# Altium schematic sheet Page07 CPU PHY.SchDoc
size 386 x 246 mm
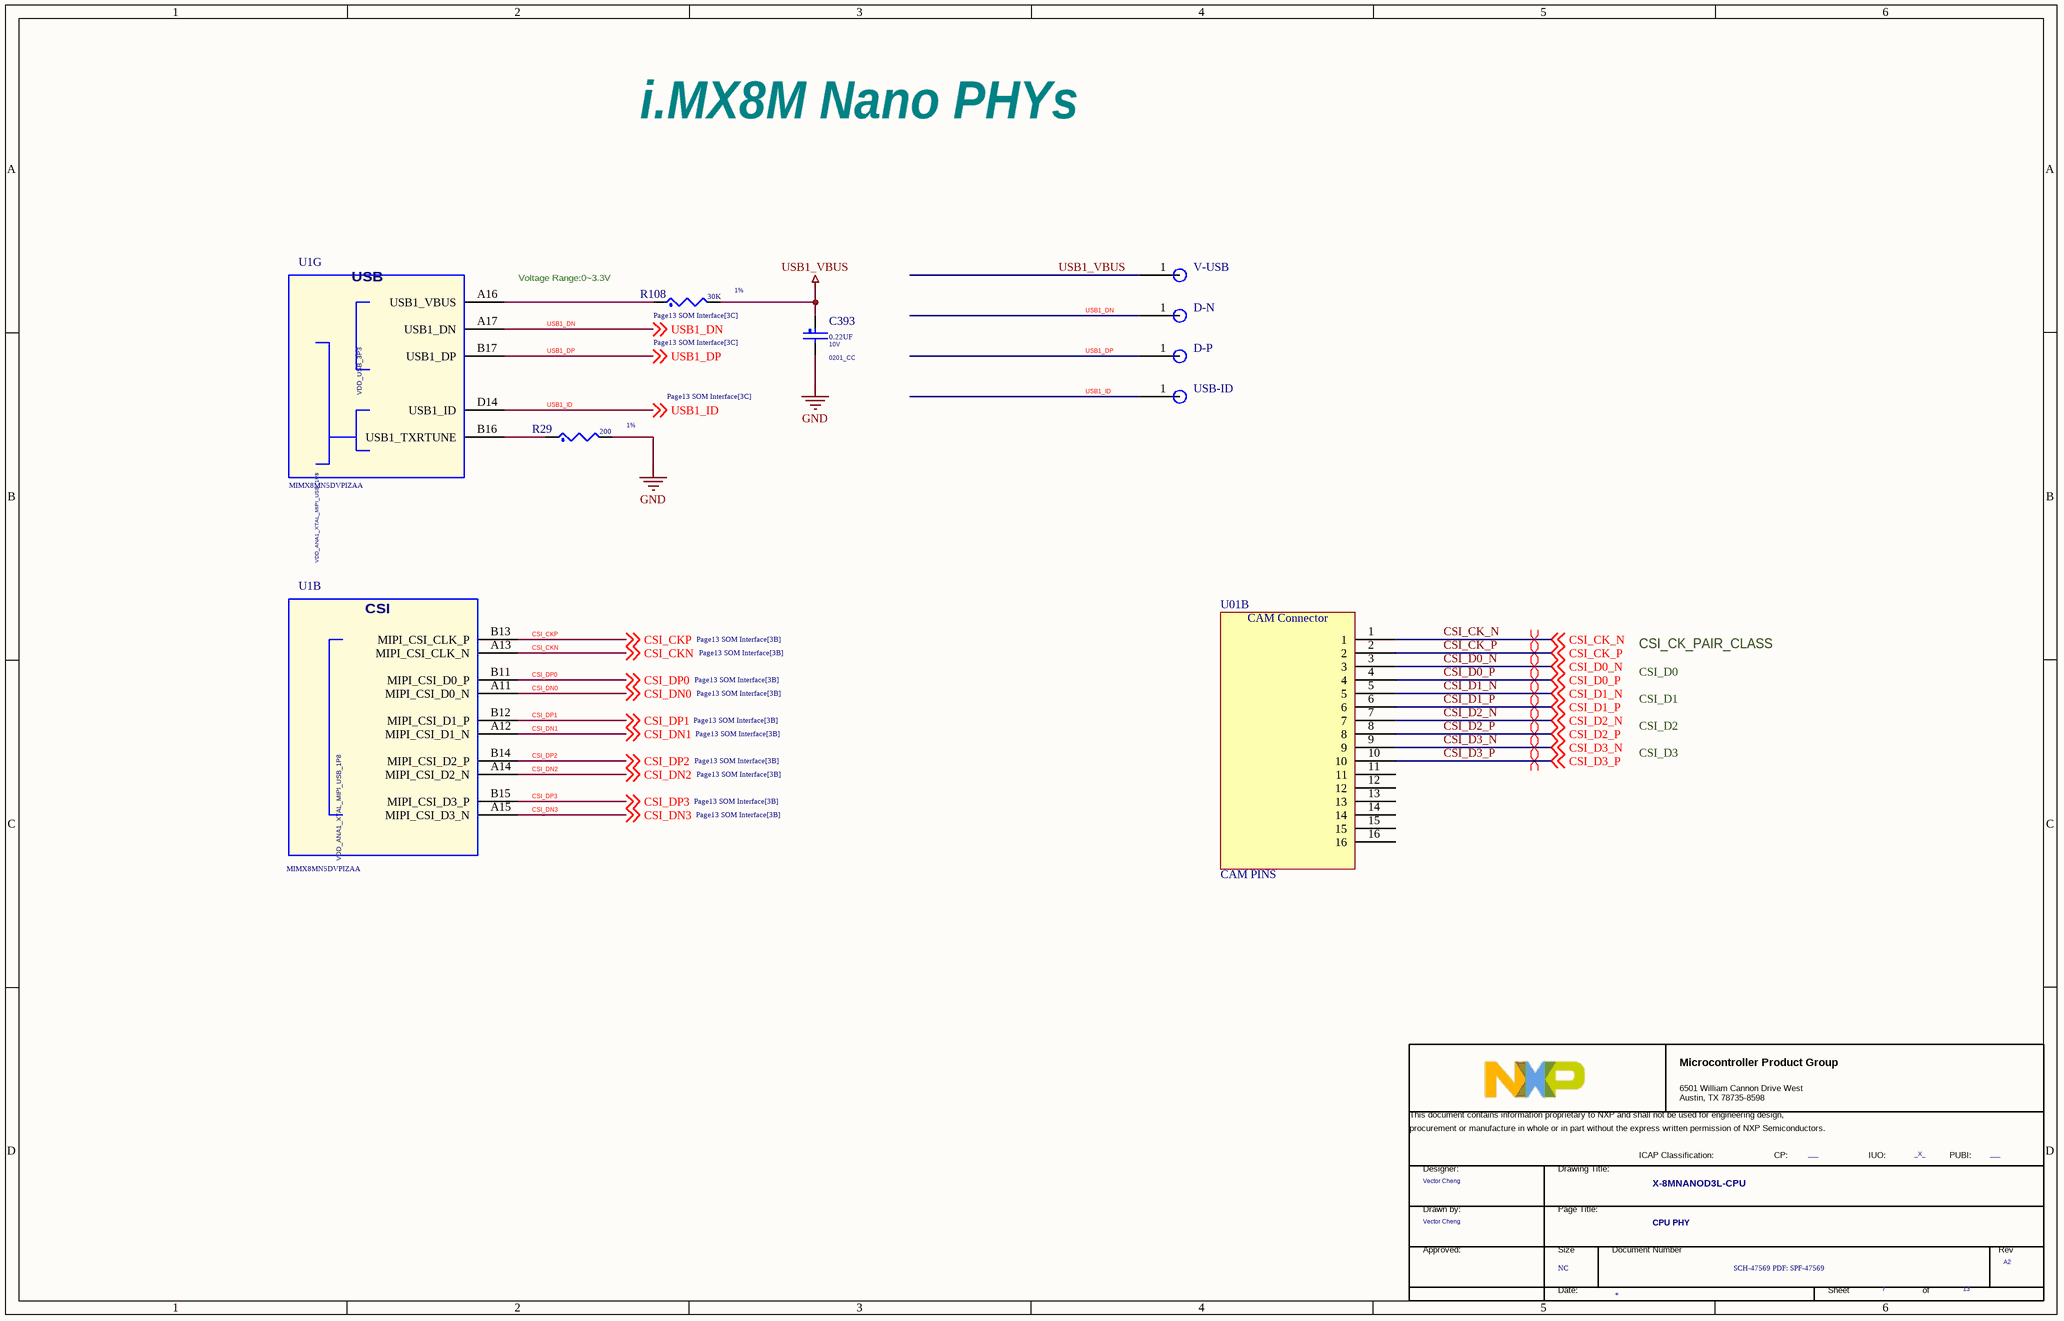
[diagram p0: Page07 CPU PHY.SchDoc]

## Parts
*  FCP: ___  FIUO: _X_  DrawnBy: Vector Cheng  PageTitle: CPU PHY  Page Count: 13  Page Number: 7  Page Size: NC  Title: X-8MNANOD3L-CPU  RevCode: A2  Doc: SCH-47569 PDF: SPF-47569  (hidden comment: TitleBlock_MCPG)  (graphical)
C393  0.22UF  VOLTAGE: 10V  PCB Footprint: 0201_CC  [0201_CC - C]
D-N  Test Pin1  [Test Pin]  (value not drawn)
D-P  Test Pin1  [Test Pin]  (value not drawn)
R29  200  Tolerance: 1%  [0201_RES]
R108  30K  Tolerance: 1%  [0201_RES]
U1  MIMX8MN5DVPIZAA  [BGA306C50P21X21_1100X1100X101]  (parts B,G of 12)
U01B  CAM PINS  [CAM Footprint]
USB-ID  Test Pin1  [Test Pin]  (value not drawn)
V-USB  Test Pin1  [Test Pin]  (value not drawn)

## Nets
GND: C393.2 R29.2
USB1_VBUS: C393.1 R108.2 V-USB.1
CSI_CK_N: U01B.1 ; off-sheet CSI_CK_N
CSI_CK_P: U01B.2 ; off-sheet CSI_CK_P
CSI_CKN: U1.A13(MIPI_CSI_CLK_N) ; off-sheet CSI_CKN
CSI_CKP: U1.B13(MIPI_CSI_CLK_P) ; off-sheet CSI_CKP
CSI_D0_N: U01B.3 ; off-sheet CSI_D0_N
CSI_D0_P: U01B.4 ; off-sheet CSI_D0_P
CSI_D1_N: U01B.5 ; off-sheet CSI_D1_N
CSI_D1_P: U01B.6 ; off-sheet CSI_D1_P
CSI_D2_N: U01B.7 ; off-sheet CSI_D2_N
CSI_D2_P: U01B.8 ; off-sheet CSI_D2_P
CSI_D3_N: U01B.9 ; off-sheet CSI_D3_N
CSI_D3_P: U01B.10 ; off-sheet CSI_D3_P
CSI_DN0: U1.A11(MIPI_CSI_D0_N) ; off-sheet CSI_DN0
CSI_DN1: U1.A12(MIPI_CSI_D1_N) ; off-sheet CSI_DN1
CSI_DN2: U1.A14(MIPI_CSI_D2_N) ; off-sheet CSI_DN2
CSI_DN3: U1.A15(MIPI_CSI_D3_N) ; off-sheet CSI_DN3
CSI_DP0: U1.B11(MIPI_CSI_D0_P) ; off-sheet CSI_DP0
CSI_DP1: U1.B12(MIPI_CSI_D1_P) ; off-sheet CSI_DP1
CSI_DP2: U1.B14(MIPI_CSI_D2_P) ; off-sheet CSI_DP2
CSI_DP3: U1.B15(MIPI_CSI_D3_P) ; off-sheet CSI_DP3
USB1_DN: D-N.1 U1.A17(USB1_DN) ; off-sheet USB1_DN
USB1_DP: D-P.1 U1.B17(USB1_DP) ; off-sheet USB1_DP
USB1_ID: U1.D14(USB1_ID) USB-ID.1 ; off-sheet USB1_ID
NetR29_1: R29.1 U1.B16(USB1_TXRTUNE)
NetR108_1: R108.1 U1.A16(USB1_VBUS)

Not connected (* = marked no-connect by the designer): U01B 11 12 13 14 15 16

## Layout directives
differential pair; differential pair class CSI_CK_PAIR_CLASS: CSI_CK_N
differential pair: CSI_CK_P, CSI_D0_P, CSI_D1_P, CSI_D2_P, CSI_D3_P
differential pair; differential pair class CSI_D0: CSI_D0_N
differential pair; differential pair class CSI_D1: CSI_D1_N
differential pair; differential pair class CSI_D2: CSI_D2_N
differential pair; differential pair class CSI_D3: CSI_D3_N

## Notes on the sheet
- i.MX8M Nano PHYs
- Voltage Range:0~3.3V
- (in symbol CAM PINS) CAM Connector
- (in symbol MIMX8MN, part B) CSI
- (in symbol MIMX8MN, part G) USB
- (in symbol TitleBlock_MCPG) Microcontroller Product Group; 6501 William Cannon Drive West / Austin, TX 78735-8598; This document contains information proprietary to NXP and shall not be used for engineering design,; procurement or manufacture in whole or in part without the express written permission of NXP Semiconductors.; ICAP Classification:; CP:; IUO:; PUBI:; Designer:; Drawing Title:; Drawn by:; Page Title:; Approved:; Size; Document Number; Rev; Date:; Sheet; of

## Library data of the parts
* = TitleBlock_MCPG: OrgAddr1: NO. 192 Liangjing Rd. Pudong New Area, ShangHai; OrgName: NXP Semiconductor; PUBI: ___; Designer: Vector Cheng; Page Create Date: March  8, 1995; Page Modify Date: *
C393 = CAP_NP: CAP CER 0.22UF 10V 20% X5R 0201; CLASS: DISCRETE; FPLIST: CC0201,CC0201_HD,0201_CC; CAD_APPROVED: Yes; MFG_PN01: LMK063BJ224MP-F; MFG_NAME01: Taiyo Yuden; AGILE_PN: 150-78815; HEIGHT: 0.33MM; ROHS: Yes; Tolerance: 20%
R29 = RES: RES MF 200 OHM 1/20W 1% 0201; CLASS: DISCRETE; PCB Footprint: 0201_CC; FPLIST: RC0201,0201_CC; CAD_APPROVED: Yes; Temp_Range: -55¡ãC ~ 125¡ãC; MFG_PN01: RC0201FR-07200RL; MFG_NAME01: YAGEO AMERICA; AGILE_PN: 470-82323; VOLTAGE: 25V; HEIGHT: 0.26MM; ROHS: Yes; Temp Range: -55¡ãC ~ 125¡ãC
R108 = RES: RES MF 30K 1/20W 1% 0201; CLASS: DISCRETE; Temp Range: -55¡ãC ~ 155¡ãC; VOLTAGE: 25V; PCB Footprint: 0201_CC; AGILE_PN: 470-81353; MFG_NAME01: YAGEO AMERICA; MFG_PN01: RC0201FR-0730KL; CAD_APPROVED: Yes; FPLIST: RC0201,0201_CC; ROHS: Yes; Temp_Range: -55¡ãC ~ 155¡ãC; HEIGHT: 0.26MM
U1 = MIMX8MN: IC CPU QUAD CORTEX A53+M7 1.4GHZ -- BGA306; PCB Footprint: pbga306_0p5_sq11mm; AGILE_PN: TMP-CIP-5098; CAD_APPROVED: Yes; PRE_APN: 330-77152; Temp Range: -40¡ãC to 105¡ãC; MFG_NAME01: NXP SEMICONDUCTORS; MFG_PN01: MIMX8MN5CVPIZAA; CLASS: IC; HEIGHT: 1.01MM; ROHS: Yes